# EAGLE design daughter (EAGLE 6.5.0)
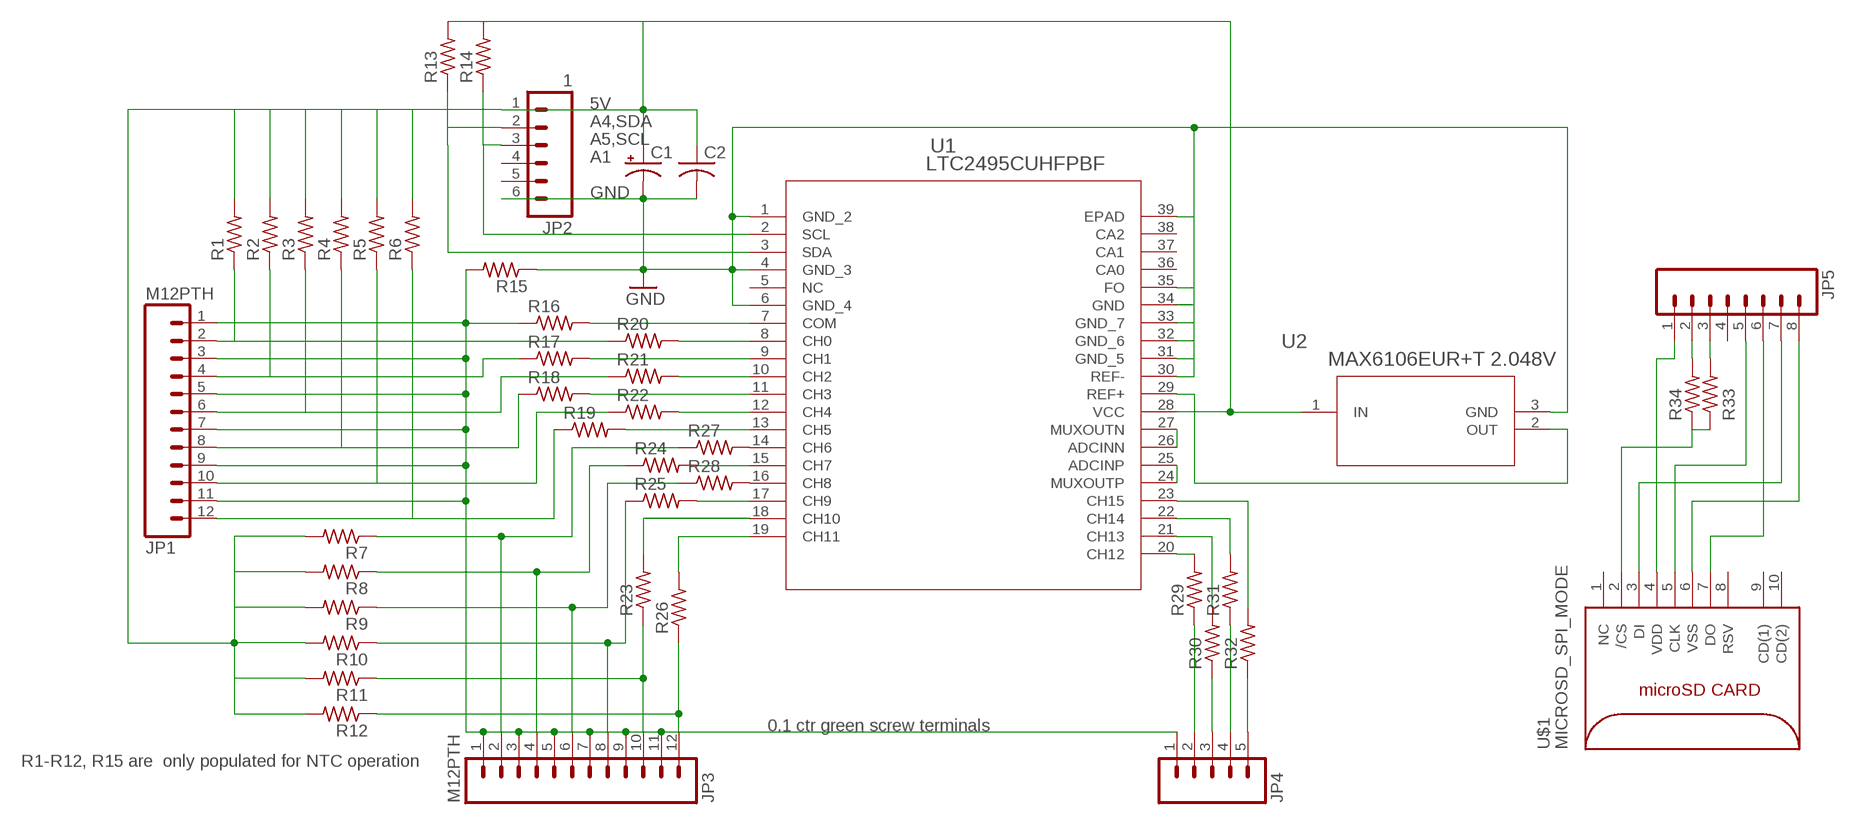
[diagram p0: schematic, sheet 1]

## Parts
C1  CPOL-USSMCB  [SMC_B]
C2  C-USC0805  [C0805]
JP1  M12PTH  [1X12]
JP2  1  M06SIP  [1X06]
JP3  M12PTH  [1X12]
JP4  M05PTH  [1X05]
JP5  M081X08  [1X08]
R1  R-US_R0603  [R0603]
R2  R-US_R0603  [R0603]
R3  R-US_R0603  [R0603]
R4  R-US_R0603  [R0603]
R5  R-US_R0603  [R0603]
R6  R-US_R0603  [R0603]
R7  R-US_R0603  [R0603]
R8  R-US_R0603  [R0603]
R9  R-US_R0603  [R0603]
R10  R-US_R0603  [R0603]
R11  R-US_R0603  [R0603]
R12  R-US_R0603  [R0603]
R13  R-US_R0603  [R0603]
R14  R-US_R0603  [R0603]
R15  R-US_R0603  [R0603]
R16  R-US_R0603  [R0603]
R17  R-US_R0603  [R0603]
R18  R-US_R0603  [R0603]
R19  R-US_R0603  [R0603]
R20  R-US_R0603  [R0603]
R21  R-US_R0603  [R0603]
R22  R-US_R0603  [R0603]
R23  R-US_R0603  [R0603]
R24  R-US_R0603  [R0603]
R25  R-US_R0603  [R0603]
R26  R-US_R0603  [R0603]
R27  R-US_R0603  [R0603]
R28  R-US_R0603  [R0603]
R29  R-US_R0603  [R0603]
R30  R-US_R0603  [R0603]
R31  R-US_R0603  [R0603]
R32  R-US_R0603  [R0603]
R33  R-US_R0603  [R0603]
R34  R-US_R0603  [R0603]
U1  LTC2495CUHFPBF  [QFN-38_UHF]
U2  MAX6106EUR+T 2.048V  MAX6106EUR+T  [21-0051H]
U$1  MICROSD_SPI_MODE  [MICRO_SD_CONNECTOR]

## Nets
GND: C1.- C2.2 JP2.6 R15.1 U1.1(GND_2) U1.4(GND_3) U1.6(GND_4) U1.30(REF-) U1.31(GND_5) U1.32(GND_6) U1.33(GND_7) U1.34(GND) U1.35(FO) U1.39(EPAD) U2.3(GND)
N$1: JP1.2 R1.1 R20.1
N$2: JP1.1 JP1.3 JP1.5 JP1.7 JP1.9 JP1.11 JP3.1 JP3.3 JP3.5 JP3.7 JP3.9 JP3.11 JP4.1 R15.2 R16.1
N$5: JP1.4 R2.1 R17.1
N$6: JP1.6 R3.1 R21.1
N$7: JP5.5 U$1.5(CLK)
N$8: JP1.8 R4.1 R18.1
N$9: JP1.10 R5.1 R22.1
N$10: JP1.12 R6.1 R19.1
N$11: JP3.2 R7.1 R27.1
N$12: JP3.4 R8.1 R24.1
N$13: JP3.6 R9.1 R28.1
N$14: JP3.8 R10.1 R25.1
N$15: JP3.10 R11.1 R23.1
N$16: JP3.12 R12.1 R26.1
N$17: U1.26(ADCINN) U1.27(MUXOUTN)
N$18: C1.+ C2.1 JP2.1 R1.2 R2.2 R3.2 R4.2 R5.2 R6.2 R7.2 R8.2 R9.2 R10.2 R11.2 R12.2 R13.2 R14.2 U1.28(VCC) U2.1(IN)
N$19: U1.24(MUXOUTP) U1.25(ADCINP)
N$20: R20.2 U1.8(CH0)
N$21: JP2.2 R13.1 U1.3(SDA)
N$22: JP2.3 R14.1 U1.2(SCL)
N$23: R32.2 U1.23(CH15)
N$24: R31.2 U1.22(CH14)
N$25: R30.2 U1.21(CH13)
N$26: R29.2 U1.20(CH12)
N$27: R17.2 U1.9(CH1)
N$28: U1.29(REF+) U2.2(OUT)
N$29: R22.2 U1.12(CH4)
N$30: R21.2 U1.10(CH2)
N$31: R27.2 U1.14(CH6)
N$32: R18.2 U1.11(CH3)
N$33: R19.2 U1.13(CH5)
N$34: R24.2 U1.15(CH7)
N$35: R28.2 U1.16(CH8)
N$36: R25.2 U1.17(CH9)
N$37: R23.2 U1.18(CH10)
N$38: R26.2 U1.19(CH11)
N$39: JP4.3 R30.1
N$40: JP4.5 R32.1
N$41: JP4.2 R29.1
N$42: JP4.4 R31.1
N$43: R16.2 U1.7(COM)
N$47: R33.1 R34.1 U$1.2(/CS)
N$48: JP5.7 U$1.3(DI)
N$49: JP5.6 U$1.7(DO)
N$50: JP5.8 U$1.6(VSS)
N$51: JP5.1 U$1.4(VDD)
N$52: JP5.3 R33.2
N$53: JP5.2 R34.2
Unconnected: JP2.4 JP2.5 JP5.4 U1.5(NC) U1.36(CA0) U1.37(CA1) U1.38(CA2) U$1.1(NC) U$1.8(RSV) U$1.9(CD(1)) U$1.10(CD(2))

## Notes on the sheet
- 5V
- A4,SDA
- A5,SCL
- A1
- GND
- 0.1 ctr green screw terminals
- R1-R12, R15 are  only populated for NTC operation

## Library data of the parts
C1 = rcl:CPOL-US: POLARIZED CAPACITOR, American symbol
C2 = rcl:C-US: CAPACITOR, American symbol
JP1 JP3 = SparkFun-Connectors:M12: Header 12 Standard 12-pin 0.1" header. Use with straight break away headers (SKU : PRT-00116), right angle break away headers (PRT-00553), swiss pins (PRT-00743), machine pins (PRT-00117), and female headers (PRT-00115).
JP2 = SparkFun-Connectors:M06: Header 6 Standard 6-pin 0.1" header. Use with straight break away headers (SKU : PRT-00116), right angle break away headers (PRT-00553), swiss pins (PRT-00743), machine pins (PRT-00117), and female headers (PRT-00115). Molex polarized connector foot print use with SKU : PRT-08094 with associated crimp pins and housings. NOTES ON THE VARIANTS LOCK and LOCK_LONGPADS... This footprint was designed to help hold the alignment of a through-hole component (i.e. 6-pin header) while soldering it into place. You may notice that each hole has been shifted either up or down by 0.005 of an inch from it's more standard position (which is a perfectly straight line). This slight alteration caused the pins (the squares in the middle) to touch the edges of the holes. Because they are alternating, it causes a "brace" to hold the component in place. 0.005 has proven to be the perfect amount of "off-center" position when using our standard breakaway headers. Although looks a little odd when you look at the bare footprint, once you have a header in there, the alteration is very hard to notice. Also, if you push a header all the way into place, it is covered up entirely on the bottom side. This idea of altering the position of holes to aid alignment will be further integrated into the Sparkfun Library for other footprints. It can help hold any component with 3 or more connection pins.
JP4 = SparkFun-Connectors:M05: Header 5 Standard 5-pin 0.1" header. Use with straight break away headers (SKU : PRT-00116), right angle break away headers (PRT-00553), swiss pins (PRT-00743), machine pins (PRT-00117), and female headers (PRT-00115). Molex polarized connector foot print use with SKU : PRT-08230 with associated crimp pins and housings.
JP5 = SparkFun-Connectors:M08: Header 8 Standard 8-pin 0.1" header. Use with straight break away headers (SKU : PRT-00116), right angle break away headers (PRT-00553), swiss pins (PRT-00743), machine pins (PRT-00117), and female headers (PRT-00115).
R1-R34 = rcl:R-US_: RESISTOR, American symbol
U1 = LTC2495:LTC2495CUHFPBF; MANUFACTURER_PART_NUMBER: ltc2495cuhf#pbf; VENDOR: Linear Technology
U2 = Max6106EUR:MAX6106EUR+T; MANUFACTURER_PART_NUMBER: MAX6106EUR+T; VENDOR: Maxim Integrated Products
U$1 = con-molex-microsd:MICROSD_SPI_MODE: MOLEX - 49225-0821 - CONNECTEUR MICRO SD PUSH/PUSH REV Fabricant: MOLEX Code commande Farnell: 1366700 <http://fr.farnell.com/molex/49225-0821/connecteur-micro-sd-push-push-rev/dp/1366700?Ntt=1366700> Référence fabricant: 49225-0821

## Net classes
1 vcc: width 0.254 mm

## Board
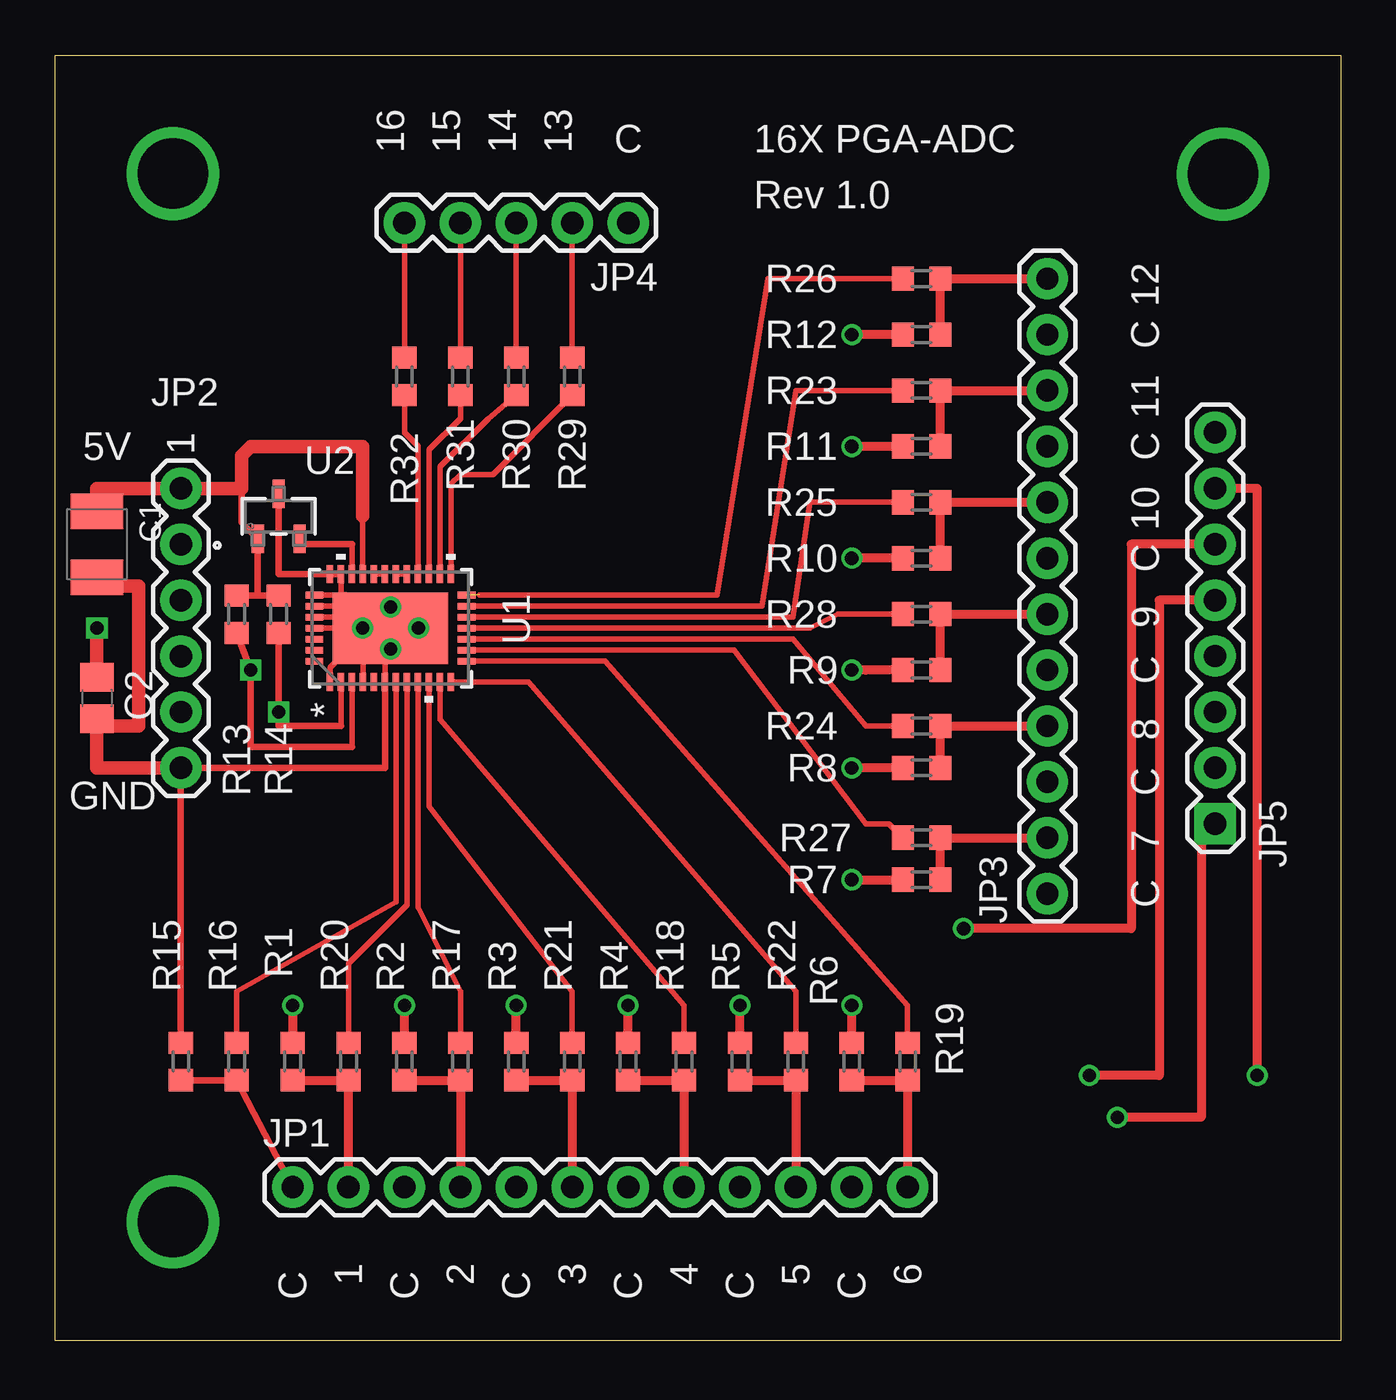
[diagram p1: board, top side]
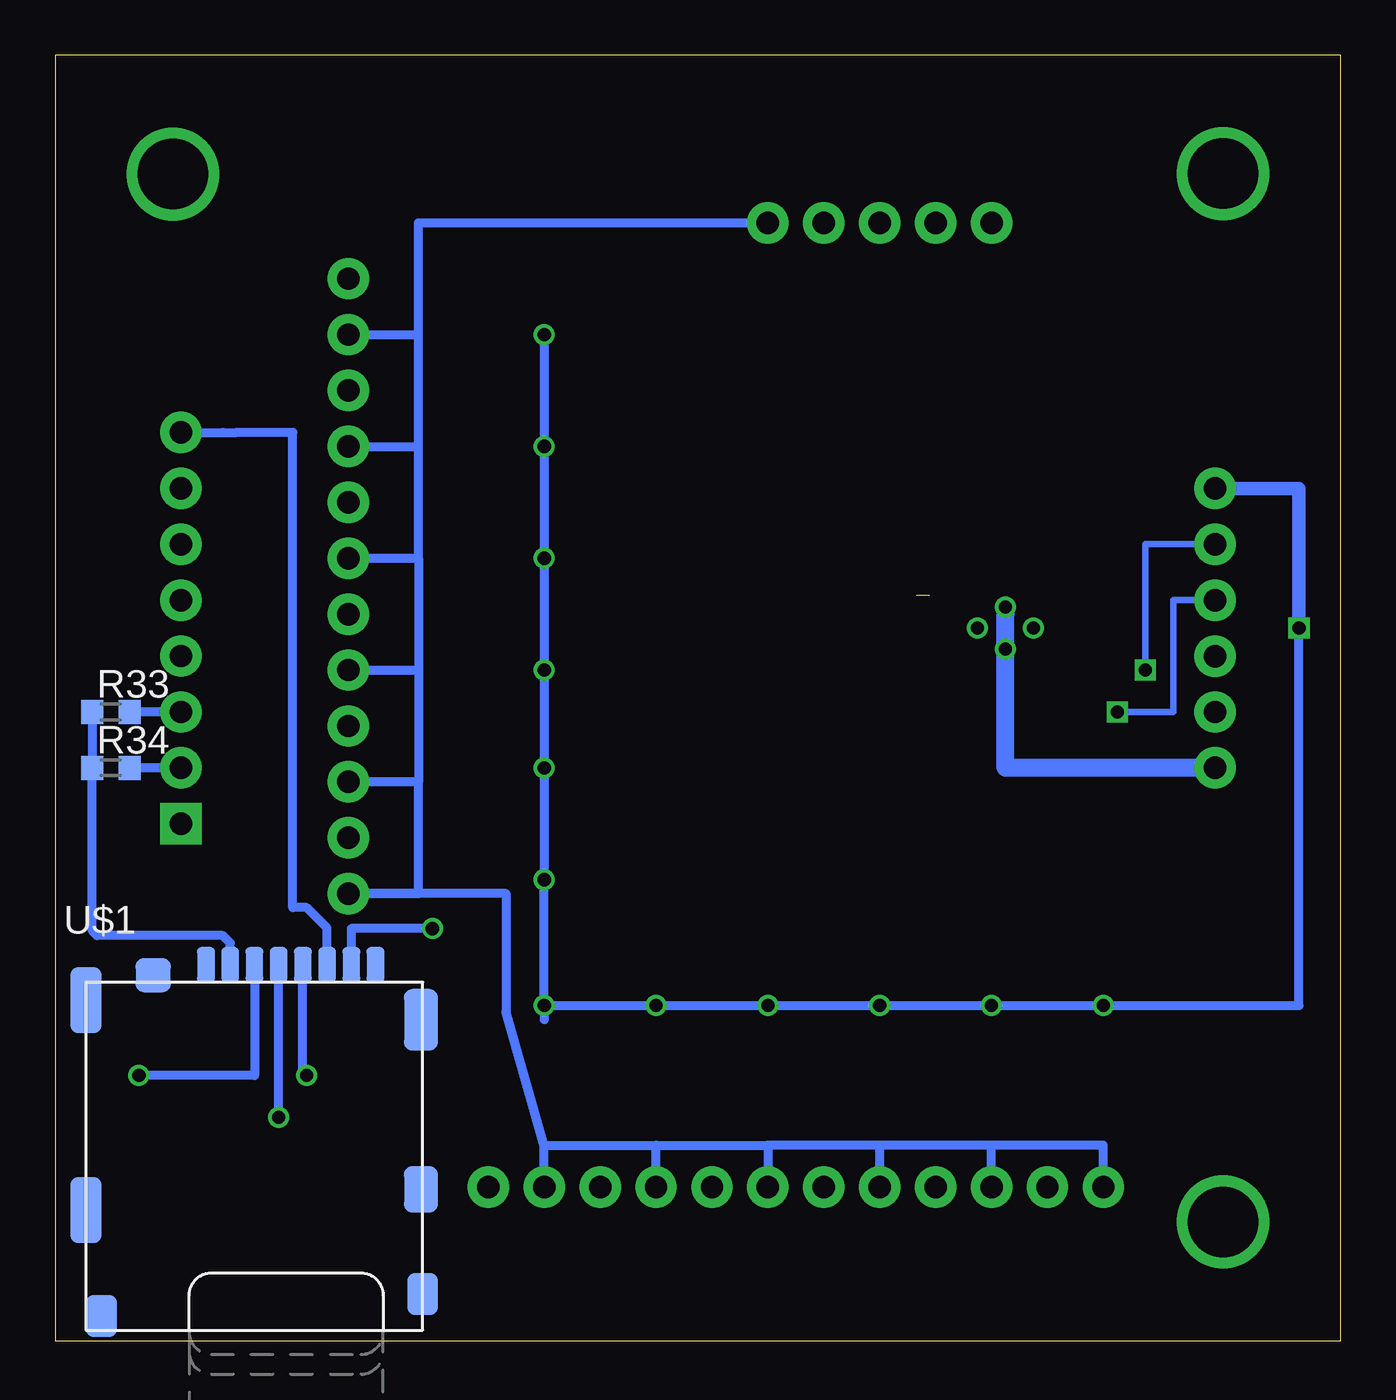
[diagram p2: board, bottom side, seen from below]

Size 58.42 x 58.42 mm. Coordinates in mm from the lower left corner, seen from the top.
Outline: 0,58.42 58.42,58.42 58.42,0 0,0 0,58.42
Copper layers (1*16): Top 0.0356mm / dielectric 1.5011mm / Bottom 0.0356mm
Design rules "OSH": minimum track width 6mil, minimum drill 13mil, track to track 6mil, track to pad 6mil, pad to pad 6mil, via to via 6mil, smd to smd 6mil, copper to edge 15mil, drill to drill 6mil, minimum pad ring 7mil, minimum via ring 7mil, stop-mask expansion 3mil, vias tented up to drill 0mil, thermal gap 10mil

### Footprints (pad centres in the part's own frame; a part is rotated, then mirrored left to right if it is on the bottom)
SMC_B = smd 1.6 x 2.4: + -1.5,0; - 1.5,0
C0805 = smd 1.3 x 1.5: 1 -0.95,0; 2 0.95,0
1X12 = drill 1.016 pad 1.88: 1 0,0; 2 2.54,0; 3 5.08,0; 4 7.62,0; 5 10.16,0; 6 12.7,0; 7 15.24,0; 8 17.78,0; 9 20.32,0; 10 22.86,0; 11 25.4,0; 12 27.94,0
1X06 = drill 1.016 pad 1.88: 1 0,0; 2 2.54,0; 3 5.08,0; 4 7.62,0; 5 10.16,0; 6 12.7,0
1X05 = drill 1.016 pad 1.88: 1 0,0; 2 2.54,0; 3 5.08,0; 4 7.62,0; 5 10.16,0
1X08 = drill 1.016 pad 1.88 square: 1 0,0 | drill 1.016 pad 1.88: 2 2.54,0; 3 5.08,0; 4 7.62,0; 5 10.16,0; 6 12.7,0; 7 15.24,0; 8 17.78,0
R0603 = smd 1 x 1.1: 1 -0.85,0; 2 0.85,0
QFN-38_UHF = smd 0.805 x 0.3: 1 -2.452,2.75; 2 -2.452,2.25; 3 -2.452,1.75; 4 -2.452,1.25; 5 -2.452,0.75; 6 -2.452,0.25; 7 -2.452,-0.25; 8 -2.452,-0.75; 9 -2.452,-1.25; 10 -2.452,-1.75; 11 -2.452,-2.25; 12 -2.452,-2.75; 20 2.452,-2.75; 21 2.452,-2.25; 22 2.452,-1.75; 23 2.452,-1.25; 24 2.452,-0.75; 25 2.452,-0.25; 26 2.452,0.25; 27 2.452,0.75; 28 2.452,1.25; 29 2.452,1.75; 30 2.452,2.25; 31 2.452,2.75 | smd 0.3 x 0.805: 13 -1.5,-3.452; 14 -1,-3.452; 15 -0.5,-3.452; 16 0,-3.452; 17 0.5,-3.452; 18 1,-3.452; 19 1.5,-3.452; 32 1.5,3.452; 33 1,3.452; 34 0.5,3.452; 35 0,3.452; 36 -0.5,3.452; 37 -1,3.452; 38 -1.5,3.452 | smd 3.25 x 5.25: 39 0,0
21-0051H = smd 0.559 x 1.295: 1 -0.95,-1.029; 2 0.95,-1.029; 3 0,1.029
MICRO_SD_CONNECTOR = smd 0.8 x 1.6: 1 -2.03,8.2; 2 -0.93,8.2; 3 0.17,8.2; 4 1.27,8.2; 5 2.37,8.2; 6 3.47,8.2; 7 4.57,8.2; 8 5.67,8.2 | smd 1.55 x 2.8: 9 7.735,5.7 | smd 1.55 x 2.1: 10 7.735,-2 | smd 1.4 x 1.9: 11 7.81,-6.75; 12 -6.79,-7.75 | smd 1.4 x 3: 13 -7.49,-2.95; 14 -7.49,6.6 | smd 1.6 x 1.55: 15 -4.43,7.725

### Placement (x,y rotation side)
C1  1.91,36.2 270 top
C2  1.91,29.21 270 top
JP1  10.8,6.99 0 top
JP2  5.72,38.73 270 top
JP3  45.09,20.32 90 top
JP4  26.04,50.8 180 top
JP5  52.7,23.5 90 top
R1  10.8,12.7 90 top
R2  15.88,12.7 90 top
R3  20.96,12.7 90 top
R4  26.04,12.7 90 top
R5  31.12,12.7 90 top
R6  36.2,12.7 90 top
R7  39.37,20.96 180 top
R8  39.37,26.04 180 top
R9  39.37,30.48 180 top
R10  39.37,35.56 180 top
R11  39.37,40.64 180 top
R12  39.37,45.72 180 top
R13  8.25,33.02 90 top
R14  10.16,33.02 90 top
R15  5.72,12.7 270 top
R16  8.25,12.7 90 top
R17  18.41,12.7 90 top
R18  28.57,12.7 90 top
R19  38.73,12.7 90 top
R20  13.34,12.7 90 top
R21  23.5,12.7 90 top
R22  33.66,12.7 90 top
R23  39.37,43.18 180 top
R24  39.37,27.94 180 top
R25  39.37,38.1 180 top
R26  39.37,48.26 180 top
R27  39.37,22.86 180 top
R28  39.37,33.02 180 top
R29  23.5,43.81 270 top
R30  20.96,43.81 270 top
R31  18.41,43.81 270 top
R32  15.88,43.81 270 top
R33  55.88,28.57 0 bottom
R34  55.88,26.04 0 bottom
U1  15.24,32.38 90 top
U2  10.16,37.47 0 top
U$1  49.53,8.89 0 bottom

### Tracks (layer width: path | path; a pad name or v marks a point on that pad's centre or on a via)
GND  (via drill 0.6)
  Top 0.254: U1.32 13.11,33.88 | U1.33 13.07,33.38 | U1.34 13.2,32.88 | U1.35 13.34,32.38 | U1.30 12.99,33.02 | U1.6 14.99,31.12 | U1.4 13.99,31.12 | U1.1 12.49,30.59 13.02,31.12
  Top 0.305: U1.6 14.99,26.03 JP2.6 | 13.11,33.88 arc-90 13.34,33.66 arc-90 13.07,33.38 13.07,33.29 13.34,33.02 | 13.34,33.02 arc-90 13.2,32.88 13.2,32.52 13.34,32.38 v13.97,32.38 U1.39 14.99,32.38 14.99,31.12 13.99,31.12 13.34,31.12 13.02,31.12 | 12.99,33.02 13.34,33.02 | U1.30 U1.31 10.16,34.84 U2.3 | R15.1 JP2.6
  Top 0.61: JP2.6 1.91,26.03 C2.2 1.91,27.94 3.81,27.94 3.81,34.29 2.31,34.29 arc-90 C1.-
N$1
  Top 0.406: R1.1 R20.1 JP1.2
N$2
  Top 0.305: R15.2 R16.1 JP1.1
  Bottom 0.406: JP1.1 10.8,8.89 15.88,8.89 | JP1.3 15.88,8.89 | 15.88,8.89 20.96,8.89 | JP1.5 20.96,8.89 | 20.96,8.89 26.04,8.89 | 26.04,8.89 JP1.7 | JP1.9 31.12,8.89 | 31.12,8.89 26.04,8.89 | 36.2,8.89 31.12,8.89 | JP1.11 36.2,8.89 | 36.2,8.89 37.93,14.96 37.93,20.32 JP3.1 41.91,20.32 41.91,25.4 | 41.91,25.4 JP3.3 | JP3.5 41.91,30.48 | 41.91,30.48 41.91,25.4 | 41.91,35.56 41.91,30.48 | JP3.7 41.91,35.56 | 41.91,35.56 41.91,40.64 | JP3.9 41.91,40.64 | 41.91,40.64 41.91,45.72 | JP3.11 41.91,45.72 | 41.91,45.72 41.91,50.8 JP4.1
N$3  (via drill 3.2)
  other vias: 53.06,53.01
N$4  (via drill 3.2)
  other vias: 5.36,5.41
N$5
  Top 0.406: R2.1 R17.1 JP1.4
N$6
  Top 0.406: R3.1 R21.1 JP1.6
N$7  (via drill 0.6)
  Top 0.406: JP5.5 50.16,33.66 50.16,12.07 v46.99,12.07
  Bottom 0.406: v46.99,12.07 47.16,12.07 U$1.5
N$8
  Top 0.406: R4.1 R18.1 JP1.8
N$9
  Top 0.406: R5.1 R22.1 JP1.10
N$10
  Top 0.406: R6.1 R19.1 JP1.12
N$11
  Top 0.406: R7.1 R27.1 JP3.2
N$12
  Top 0.406: R8.1 R24.1 JP3.4
N$13
  Top 0.406: R9.1 R28.1 JP3.6
N$14
  Top 0.406: JP3.8 R25.1 R10.1
N$15
  Top 0.406: JP3.10 R23.1 R11.1
N$16
  Top 0.406: R12.1 R26.1 JP3.12
N$17
  Top 0.254: U1.27 U1.26
N$18  (via drill 0.6)
  Top 0.254: 13.97,34.84 13.97,37.47
  Top 0.305: 8.47,38.73 8.47,37.18 U2.1 9.21,33.87 | 9.21,33.87 R13.2 | 9.21,33.87 R14.2 | U1.28 13.97,34.84
  Top 0.406: 36.83,26.04 R8.2 v36.2,26.04 | 36.83,30.48 R9.2 v36.2,30.48 | 38.73,35.56 R10.2 v36.2,35.56 | R12.2 v36.2,45.72 | R11.2 v36.2,40.64 | v36.2,20.96 R7.2 | R6.2 v36.2,15.24 | R5.2 v31.12,15.24 | R4.2 v26.04,15.24 | R3.2 v20.96,15.24 | R2.2 v15.88,15.24 | v10.8,15.24 R1.2
  Top 0.61: C1.+ 1.91,38.73 JP2.1 8.47,38.73 8.47,40.22 8.89,40.64 13.97,40.64 13.97,37.47 | C2.1 v1.91,32.38
  Bottom 0.406: v36.2,45.72 v36.2,40.64 v36.2,35.56 v36.2,30.48 v36.2,26.04 v36.2,20.96 v36.2,15.24 | v36.2,15.24 36.2,14.61 | v36.2,15.24 v31.12,15.24 v26.04,15.24 v20.96,15.24 v15.88,15.24 v10.8,15.24 1.91,15.24 v1.91,32.38
  Bottom 0.61: v1.91,32.38 1.91,38.73 JP2.1
N$19
  Top 0.254: U1.25 U1.24
N$20
  Top 0.254: 13.45,13.66 R20.2 13.34,17.14 15.99,19.8 U1.8
N$21  (via drill 0.6)
  Top 0.254: U1.3 13.49,26.99
  Top 0.305: 13.49,26.99 8.89,26.99 v8.89,30.48 R13.1
  Bottom 0.305: JP2.2 8.89,36.2 v8.89,30.48
N$22  (via drill 0.6)
  Top 0.254: U1.2 12.99,27.94
  Top 0.305: 12.99,27.94 10.16,27.94 v10.16,28.57 R14.1
  Bottom 0.305: JP2.3 7.62,33.66 7.62,28.57 v10.16,28.57
N$23
  Top 0.254: U1.23 16.49,40.66 15.88,41.27 R32.2
N$24
  Top 0.254: U1.22 16.99,40.48 18.41,41.91 R31.2
N$25
  Top 0.254: U1.21 17.49,39.72 19.69,41.91 R30.2
N$26
  Top 0.254: U1.20 17.99,38.95 18.41,39.37 19.9,39.37 R29.2
N$27
  Top 0.254: U1.9 16.49,19.71 18.41,15.88 R17.2
N$28
  Top 0.254: U1.29 13.49,36.2
  Top 0.305: 13.49,36.2 11.35,36.2 arc-90 U2.2
N$29
  Top 0.254: U1.12 21.5,29.93 33.66,15.88 R22.2
N$30
  Top 0.254: U1.10 16.99,24.29 23.5,15.88 R21.2
N$31
  Top 0.254: U1.14 30.84,31.38 36.83,23.5 37.88,23.5 R27.2
N$32
  Top 0.254: U1.11 17.49,28.23 28.57,15.24 R18.2
N$33
  Top 0.254: U1.13 25,30.88 38.73,15.24 R19.2
N$34
  Top 0.254: U1.15 33.52,31.88 36.83,27.94 R24.2
N$35
  Top 0.254: U1.16 34.29,32.38 35.56,33.02 R28.2
N$36
  Top 0.254: U1.17 33.52,32.88 34.29,38.1 R25.2
N$37
  Top 0.254: U1.18 32.12,33.38 33.66,43.18 R23.2
N$38  (1 unrouted)
  Top 0.254: 19.28,33.88 30.08,33.88 32.38,48.26 R26.2
N$39
  Top 0.254: R30.1 JP4.3
N$40
  Top 0.254: R32.1 JP4.5
N$41
  Top 0.254: R29.1 JP4.2
N$42
  Top 0.254: R31.1 JP4.4
N$43
  Top 0.254: U1.7 15.49,19.94 8.25,15.88 R16.2
N$44  (via drill 0.6)
  other vias: 16.51,32.38
N$45  (via drill 0.6)
  other vias: 15.24,33.34
N$46  (via drill 0.6)
  other vias: 15.24,31.43
N$47
  Bottom 0.406: R33.1 R34.1 56.73,18.63 56.52,18.41 50.8,18.41 50.46,18.07 U$1.2
N$48  (via drill 0.6)
  Top 0.406: v54.61,12.07 54.61,38.73 JP5.7
  Bottom 0.406: U$1.3 49.36,12.07 v54.61,12.07
N$49  (via drill 0.6)
  Top 0.406: JP5.6 48.9,36.2 48.9,18.73 v41.27,18.73
  Bottom 0.406: v41.27,18.73 44.96,18.73 U$1.7
N$50
  Bottom 0.406: JP5.8 50.8,41.27 50.16,41.27 47.62,41.27 47.62,19.69 46.99,19.69 46.06,18.76 U$1.6 46.04,16.43
N$51  (via drill 0.6)
  Top 0.406: JP5.1 52.07,23.5 52.07,10.16 v48.26,10.16
  Bottom 0.406: v48.26,10.16 U$1.4
N$52
  Bottom 0.406: JP5.3 R33.2
N$53
  Bottom 0.406: JP5.2 R34.2
N$54
  Bottom 0.813: 5.72,26.04 15.24,26.04 15.24,33.02
N$PAD2  (via drill 3.2)
  other vias: 5.36,53.04

### Text on the board
tPlace: 16X PGA-ADC | Rev 1.0
tNames: 16 | 15 | 14 | 13 | C | 12 | C | 11 | 5V | C | 10 | C | 9 | C | 8 | GND | C | 7 | C | C | C | C | C | C | C | 1 | 2 | 3 | 4 | 5 | 6